# EAGLE schematic CxT6 (EAGLE 4.13)
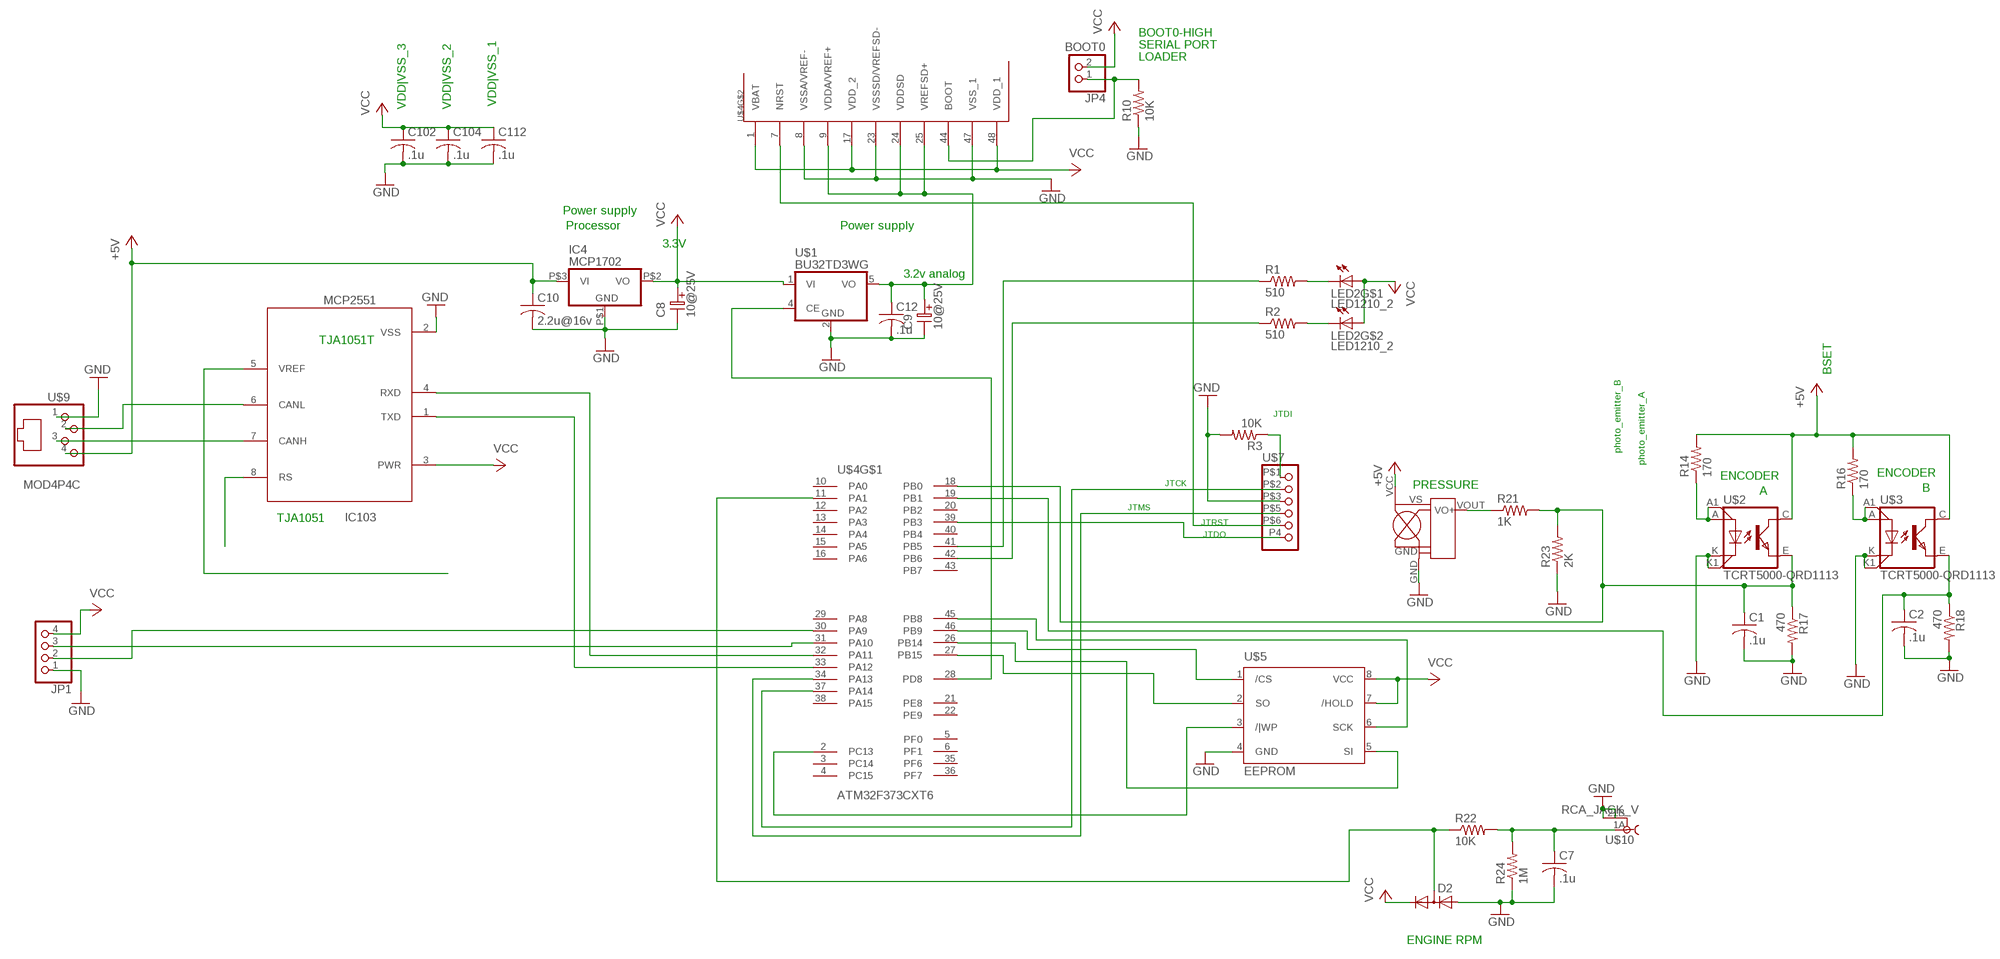
[diagram p0: schematic, sheet 1]

## Parts
C1  .1u  C-USC0805  [C0805]
C2  .1u  C-USC0805  [C0805]
C7  .1u  C-USC0805  [C0805]
C8  10@25V  ELC-2,5L  [ES-2,5L]
C9  10@25V  ELC-2,5L  [ES-2,5L]
C10  2.2u@16v  C-USC0603  [C0603]
C12  .1u  C-USC0805  [C0805]
C102  .1u  C-USC0805  [C0805]
C104  .1u  C-USC0805  [C0805]
C112  .1u  C-USC0805  [C0805]
D2  DIODE_2CACA-SOT23  [SOT23]
IC4  MCP1702  [SOT-23A]
IC103  MCP2551  [SO-08]
JP1  PINHD-1X4  [1X04]
JP4  BOOT0  PINHD-1X2  [1X02]
LED2  LED1210_2  [CHIP2LED_1210]
R1  510  R-US_R0603  [R0603]
R2  510  R-US_R0603  [R0603]
R3  10K  R-US_R0603  [R0603]
R10  10K  R-US_R0603  [R0603]
R14  170  R-US_M0805  [M0805]
R16  170  R-US_M0805  [M0805]
R17  470  R-US_R0603  [R0603]
R18  470  R-US_R0603  [R0603]
R21  1K  R-US_R0603  [R0603]
R22  10K  R-US_R0603  [R0603]
R23  2K  R-US_R0603  [R0603]
R24  1M  R-US_R0603  [R0603]
U$1  BU32TD3WG  XC6701  [SOT-25]
U$2  TCRT5000-QRD1113  [TCRT-QRD1114]
U$3  TCRT5000-QRD1113  [TCRT-QRD1114]
U$4  ATM32F373CXT6  [TQFP48]
U$5  EEPROM  [TSSOP8]
U$6  MPXV6115  [482A]
U$7  B6B-ZR  [B6B-ZR1]
U$9  MOD4P4C  [MOD4P4C]
U$10  RCA_JACK_V  [RCA_JACK_V]

## Nets
+5V: C10.1 IC4.P$3(VI) R14.2 R16.2 U$2.C(COLLECTOR) U$3.C(COLLECTOR) U$6.VCC(VS) U$9.4
B0_PHOTODETECT_A|PRESSURE: C1.1 R17.1 R21.2 R23.2 U$2.E(EMITTER) U$4.18(PB0)
B1_PHOTODETECT_B: C2.1 R18.1 U$3.E(EMITTER) U$4.19(PB1)
BOOT0: JP4.1 R10.2 U$4.44(BOOT)
CAN_RS: IC103.8(RS)
CAN_VREF|EN: IC103.5(VREF)
CANH: IC103.7(CANH) U$9.3
CANL: IC103.6(CANL) U$9.2
CANRXD: IC103.4(RXD) U$4.32(PA11)
CANTXD: IC103.1(TXD) U$4.33(PA12)
ENCODER_A_ANODE: R14.1 U$2.A1(ANODE1) U$2.A(ANODE)
ENCODER_B_ANODE: R16.1 U$3.A1(ANODE1) U$3.A(ANODE)
GND: C1.2 C2.2 C7.2 C8.2 C9.2 C10.2 C12.2 C102.2 C104.2 C112.2 D2.1(A) IC4.P$1(GND) IC103.2(VSS) JP1.1 R3.2 R10.1 R17.2 R18.2 R23.1 R24.1 U$1.2(GND) U$2.K1(CATHODE1) U$2.K(CATHODE) U$3.K1(CATHODE1) U$3.K(CATHODE) U$4.8(VSSA/VREF-) U$4.23(VSSSD/VREFSD-) U$4.47(VSS_1) U$5.4(GND) U$6.GND U$7.P$3 U$9.1 U$10.1B U$10.2
N$5: D2.3(AC) R22.1 U$4.11(PA1)
N$8: U$4.7(NRST) U$7.P$6
N$11: R3.1 U$7.P$1
PA13/JTMS/SWDIO: U$4.34(PA13) U$7.P$5
PA14/JTCLK/SWCLK: U$4.37(PA14) U$7.P$2
PB3/JTDO/TRACESWO: U$4.39(PB3) U$7.P4
PB5_LED_A: R1.1 U$4.41(PB5)
PB6_LED_B: R2.1 U$4.42(PB6)
PB8_3.2V_ENABLE: U$1.4(CE) U$4.28(PD8)
PB8_EEPROM_SCK: U$4.45(PB8) U$5.6(SCK)
PB14_EEPROM_SI: U$4.26(PB14) U$5.5(SI)
PB14_LED2: LED2.C R1.2
PB15_EEPROM_SO: U$4.27(PB15) U$5.2(SO)
PB15_LED1: LED2.C1(C) R2.2
PB_9EEPROM_/CS: U$4.46(PB9) U$5.1(/CS)
PC13_EEPROM_/WP: U$4.2(PC13) U$5.3(/|WP)
PRESSURE_OUT: R21.1 U$6.VOUT
SPRK_PICKUP: C7.1 R22.2 R24.2 U$10.1A
USART1_RX: JP1.3 U$4.31(PA10)
USART1_TX: JP1.2 U$4.30(PA9)
V3.2_ANALOG: C9.1 C12.1 U$1.5(VO) U$4.9(VDDA/VREF+) U$4.24(VDDSD) U$4.25(VREFSD+)
VCC: C8.1 C102.1 C104.1 C112.1 D2.2(C) IC4.P$2(VO) IC103.3(PWR) JP1.4 JP4.2 LED2.A LED2.A1(A) U$1.1(VI) U$4.1(VBAT) U$4.17(VDD_2) U$4.48(VDD_1) U$5.7(/HOLD) U$5.8(VCC)
Unconnected: U$4.3(PC14) U$4.4(PC15) U$4.5(PF0) U$4.6(PF1) U$4.10(PA0) U$4.12(PA2) U$4.13(PA3) U$4.14(PA4) U$4.15(PA5) U$4.16(PA6) U$4.20(PB2) U$4.21(PE8) U$4.22(PE9) U$4.29(PA8) U$4.35(PF6) U$4.36(PF7) U$4.38(PA15) U$4.40(PB4) U$4.43(PB7)

## Notes on the sheet
- BOOT0-HIGH
- SERIAL PORT
- LOADER
- VDD|VSS_3 | VDD|VSS_2 | VDD|VSS_1
- Power supply
- Processor | Power supply
- 3.3V
- 3.2v analog
- TJA1051T
- BSET
- JTDI
- photo_emitter_B
- photo_emitter_A
- ENCODER
- JTCK | ENCODER
- PRESSURE | B
- A
- JTMS
- JTRST
- TJA1051
- JTDO
- ENGINE RPM

## Library data of the parts
C1 C2 C7 C10 C12 C102 C104 C112 = rcl:C-US: CAPACITOR, American symbol
C8 C9 = DEH:ELC-2,5L
D2 = diode-1:DIODE_2CACA-: 2 Diodes - Cathode-Anode|Cathode-Anode
IC4 = linear:MCP1702
IC103 = texas:MCP2551
JP1 = pinhead:PINHD-1X4: PIN HEADER
JP4 = pinhead:PINHD-1X2: PIN HEADER
LED2 = led:LED1210_2
R1-R3 R10 R14 R16-R18 R21-R24 = rcl:R-US_: RESISTOR, American symbol
U$1 = linear:XC6701
U$2 U$3 = tcrt5000:TCRT5000-QRD1113
U$4 = stm32:ATM32F373CXT6
U$5 = texas:EEPROM
U$6 = motorola-sensor-driver:MPXV6115
U$7 = con-jst:B6B-ZR
U$9 = DEH:MOD4P4C
U$10 = DEH:RCA_JACK_V

## Net classes
0 default: width 0.203 mm, drill 0.203 mm, clearance 0.508 mm